# Altium schematic sheet MODEM_PT1.SchDoc: EC200U, SIM, USB, ANT
size 420 x 297 mm; SheetNumber: 3
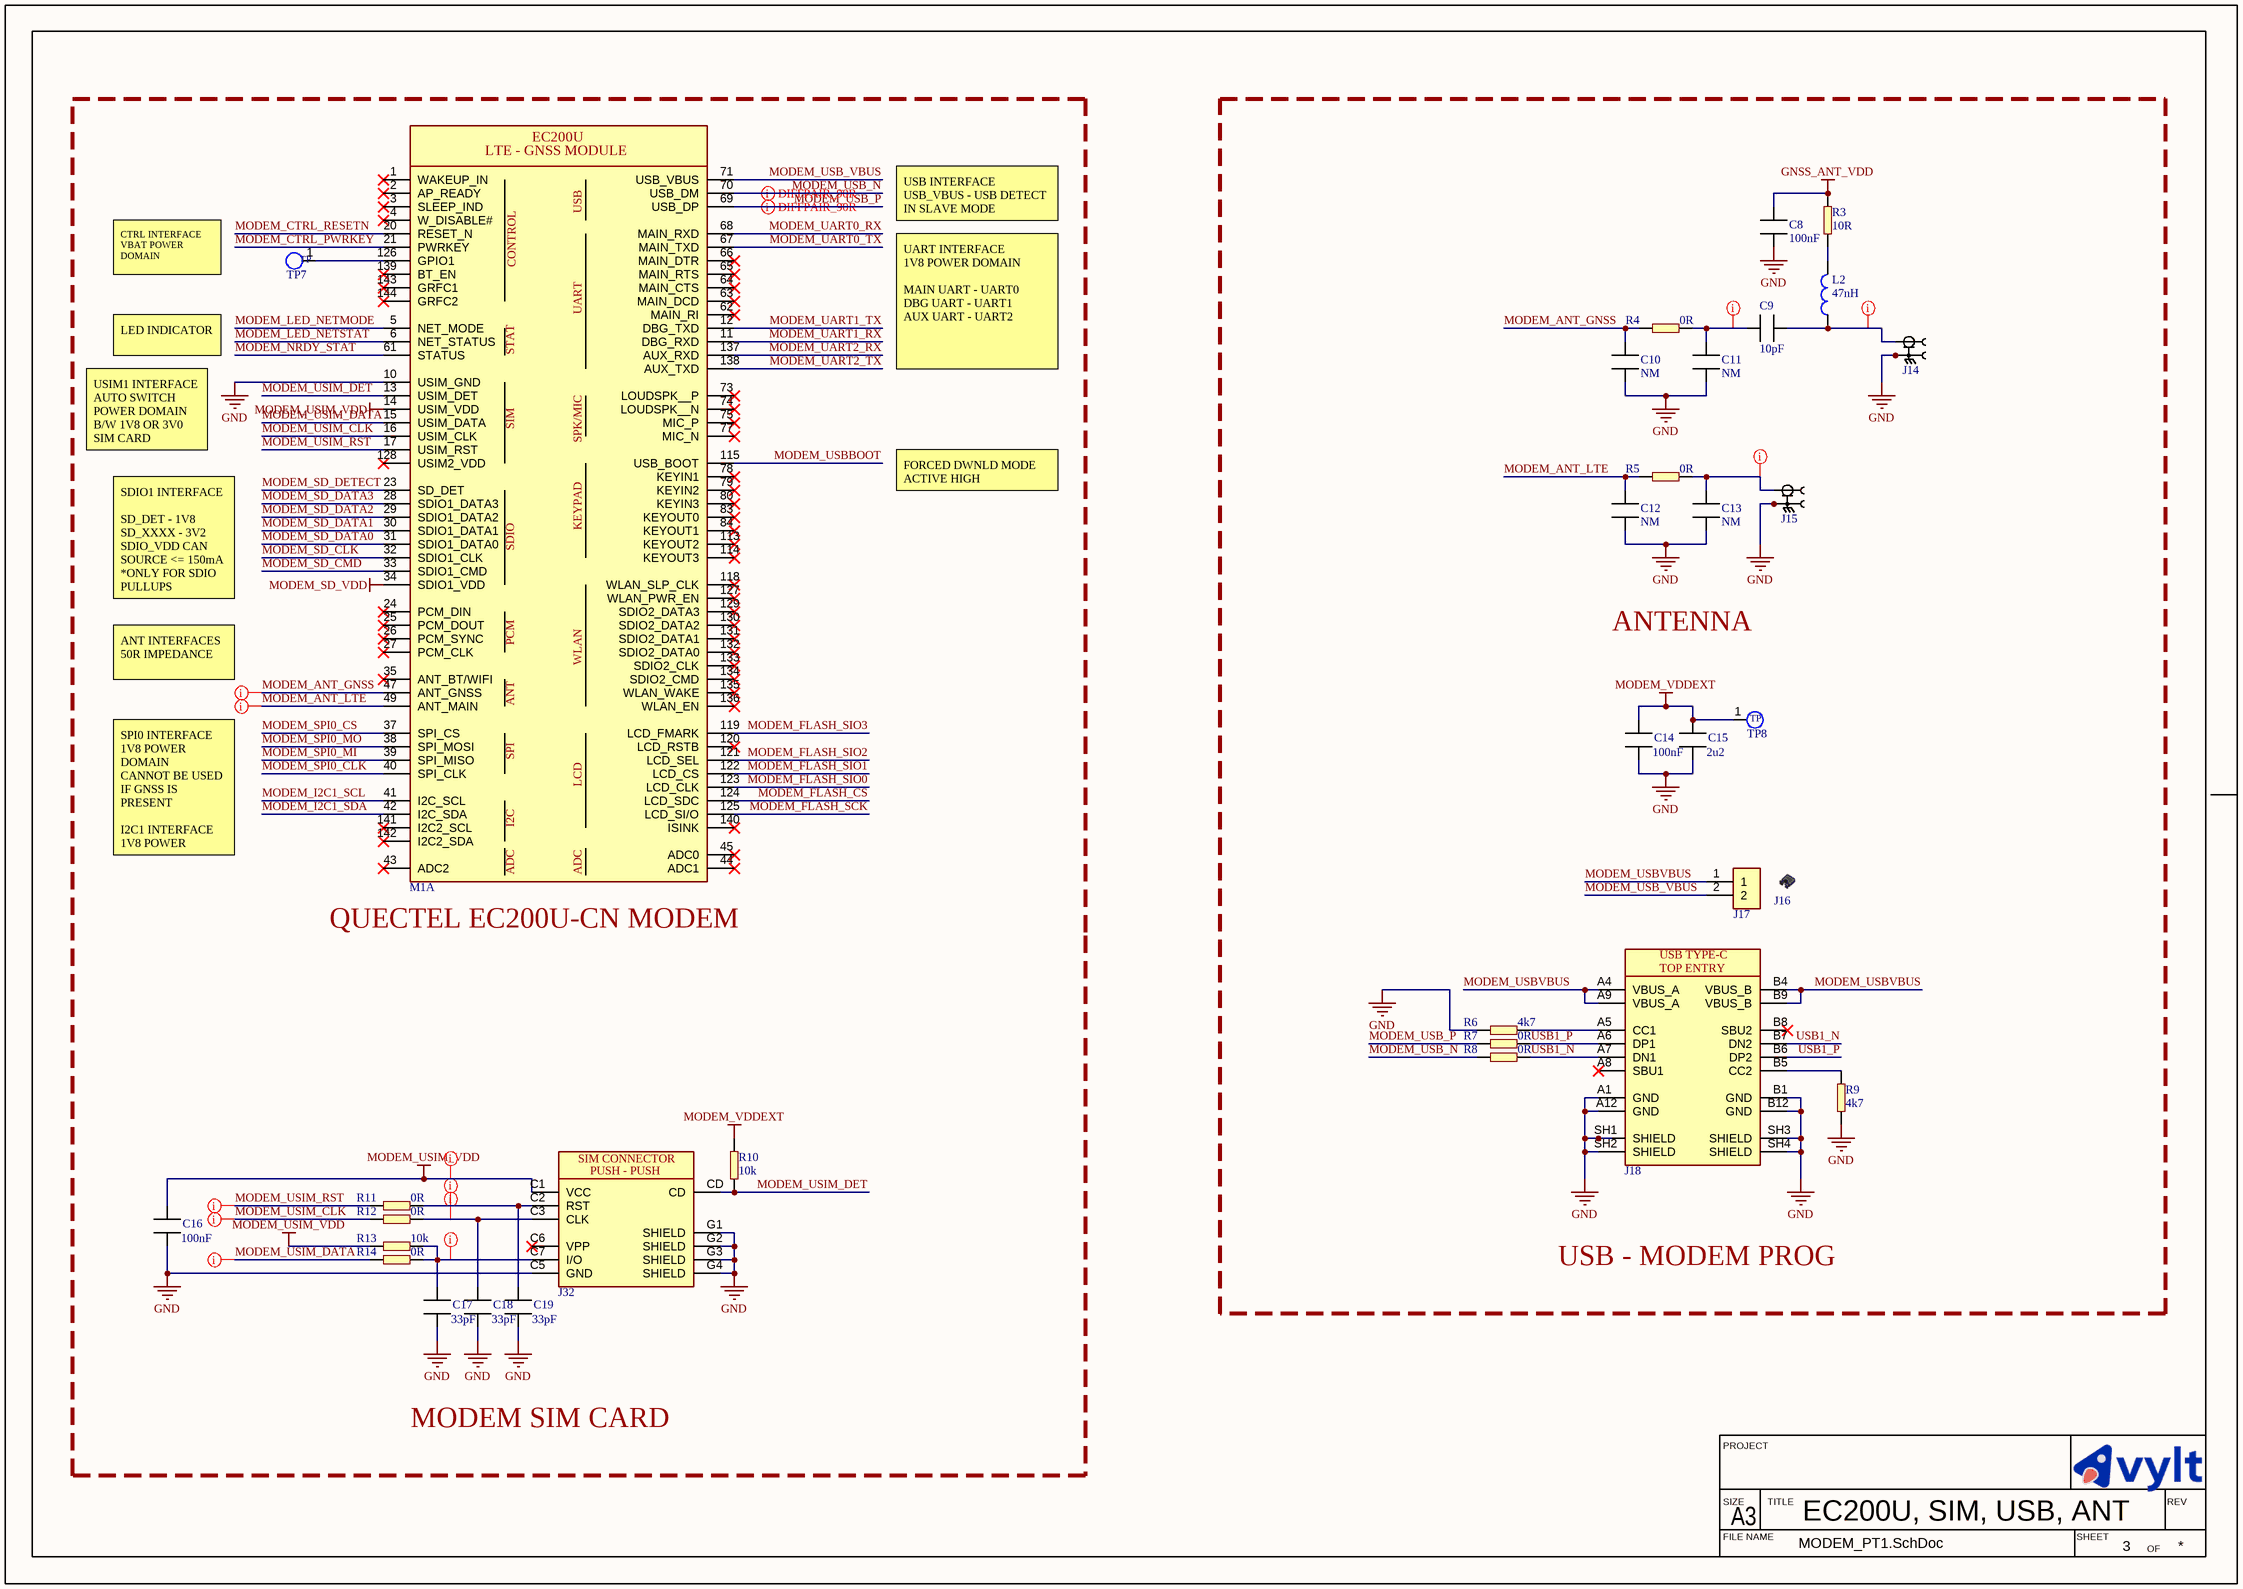
[diagram p0: MODEM_PT1.SchDoc]

## Parts
C8  value 100nF  [CAPC2012X13L]  (hidden comment: MLCC_0805)  (no BOM)
C9  value 10pF  [CAPC0603X03L]  (hidden comment: ERP_102-1)
C10  value NM  [CAPC0603X03L]  (hidden comment: ERP_102-1)  (no BOM)
C11  value NM  [CAPC0603X03L]  (hidden comment: ERP_102-1)  (no BOM)
C12  value NM  [CAPC0603X03L]  (hidden comment: ERP_102-1)  (no BOM)
C13  value NM  [CAPC0603X03L]  (hidden comment: ERP_102-1)  (no BOM)
C14  value 100nF  [CAPC2012X13L]  (hidden comment: MLCC_0805)
C15  value 2u2  [CAPC2012X13L]  (hidden comment: MLCC_0805)
C16  value 100nF  [CAPC2012X13L]  (hidden comment: MLCC_0805)
C17  value 33pF  [CAPC2012X13L]  (hidden comment: MLCC_0805)
C18  value 33pF  [CAPC2012X13L]  (hidden comment: MLCC_0805)
C19  value 33pF  [CAPC2012X13L]  (hidden comment: MLCC_0805)
J14  ERP_148-1  [uFL_50R]  (value not drawn)
J15  ERP_148-1  [uFL_50R]  (value not drawn)
J16  Jumper Cap  (value not drawn)  (mechanical)
J17  2PX1R  [2PX1R]  (value not drawn)
J18  GSB1CA11101DSHR  [GSB1CA11101DSHR]  (value not drawn)
J32  MUP-7801-1  [MUP-7801-1]  (value not drawn)
L2  value 47nH  [IND_0603]  (hidden comment: ERP_103-3)
M1  EC200U  [EC200U]  (value not drawn)  (part A of 2)
R3  value 10R  [RES_0603]  (hidden comment: ERP_101-1)
R4  value 0R  [RESC0603X03L]  (hidden comment: ERP_101-1)
R5  value 0R  [RESC0603X03L]  (hidden comment: ERP_101-1)
R6  value 4k7  [RES_0603]  (hidden comment: ERP_101-1)
R7  value 0R  [RES_0603]  (hidden comment: ERP_101-1)
R8  value 0R  [RES_0603]  (hidden comment: ERP_101-1)
R9  value 4k7  [RES_0603]  (hidden comment: ERP_101-1)
R10  value 10k  [RES_0603]  (hidden comment: ERP_101-1)
R11  value 0R  [RES_0603]  (hidden comment: ERP_101-1)
R12  value 0R  [RES_0603]  (hidden comment: ERP_101-1)
R13  value 10k  [RES_0603]  (hidden comment: ERP_101-1)
R14  value 0R  [RES_0603]  (hidden comment: ERP_101-1)
TP7  TP_1MM  [TP_1MM]  (value not drawn)  (no BOM)
TP8  TP_1MM  [TP_1MM]  (value not drawn)  (no BOM)

## Nets
GND: C8.2 C10.1 C11.1 C12.1 C13.1 C14.2 C15.2 C16.2 C17.2 C18.2 C19.2 J14.1 J14.2 J15.1 J15.2 J18.A1(GND) J18.A12(GND) J18.B1(GND) J18.B12(GND) J18.SH1(SHIELD) J18.SH2(SHIELD) J18.SH3(SHIELD) J18.SH4(SHIELD) J32.C5(GND) J32.G1(SHIELD) J32.G2(SHIELD) J32.G3(SHIELD) J32.G4(SHIELD) M1.10(USIM_GND) R6.2 R9.2
GNSS_ANT_VDD: C8.1 R3.2
MODEM_SD_VDD: M1.34(SDIO1_VDD)
MODEM_USIM_VDD: C16.1 J32.C1(VCC) M1.14(USIM_VDD) R13.2
MODEM_VDDEXT: C14.1 C15.1 R10.2 TP8.1
MODEM_ANT_GNSS: C10.2 M1.47(ANT_GNSS) R4.2
MODEM_ANT_LTE: C12.2 M1.49(ANT_MAIN) R5.2
MODEM_CTRL_PWRKEY: M1.21(PWRKEY)
MODEM_CTRL_RESETN: M1.20(RESET_N)
MODEM_FLASH_CS: M1.124(LCD_SDC)
MODEM_FLASH_SCK: M1.125(LCD_SI/O)
MODEM_FLASH_SIO0: M1.123(LCD_CLK)
MODEM_FLASH_SIO1: M1.122(LCD_CS)
MODEM_FLASH_SIO2: M1.121(LCD_SEL)
MODEM_FLASH_SIO3: M1.119(LCD_FMARK)
MODEM_I2C1_SCL: M1.41(I2C_SCL)
MODEM_I2C1_SDA: M1.42(I2C_SDA)
MODEM_LED_NETMODE: M1.5(NET_MODE)
MODEM_LED_NETSTAT: M1.6(NET_STATUS)
MODEM_NRDY_STAT: M1.61(STATUS)
MODEM_SD_CLK: M1.32(SDIO1_CLK)
MODEM_SD_CMD: M1.33(SDIO1_CMD)
MODEM_SD_DATA0: M1.31(SDIO1_DATA0)
MODEM_SD_DATA1: M1.30(SDIO1_DATA1)
MODEM_SD_DATA2: M1.29(SDIO1_DATA2)
MODEM_SD_DATA3: M1.28(SDIO1_DATA3)
MODEM_SD_DETECT: M1.23(SD_DET)
MODEM_SPI0_CLK: M1.40(SPI_CLK)
MODEM_SPI0_CS: M1.37(SPI_CS)
MODEM_SPI0_MI: M1.39(SPI_MISO)
MODEM_SPI0_MO: M1.38(SPI_MOSI)
MODEM_UART0_RX: M1.68(MAIN_RXD)
MODEM_UART0_TX: M1.67(MAIN_TXD)
MODEM_UART1_RX: M1.11(DBG_RXD)
MODEM_UART1_TX: M1.12(DBG_TXD)
MODEM_UART2_RX: M1.137(AUX_RXD)
MODEM_UART2_TX: M1.138(AUX_TXD)
MODEM_USB_N: M1.70(USB_DM) R8.2
MODEM_USB_P: M1.69(USB_DP) R7.2
MODEM_USB_VBUS: J17.2 M1.71(USB_VBUS)
MODEM_USBBOOT: M1.115(USB_BOOT)
MODEM_USBVBUS: J17.1 J18.A4(VBUS_A) J18.A9(VBUS_A) J18.B4(VBUS_B) J18.B9(VBUS_B)
MODEM_USIM_CLK: M1.16(USIM_CLK) R12.2
MODEM_USIM_DATA: M1.15(USIM_DATA) R14.2
MODEM_USIM_DET: J32.CD M1.13(USIM_DET) R10.1
MODEM_USIM_RST: M1.17(USIM_RST) R11.2
USB1_N: J18.A7(DN1) J18.B7(DN2) R8.1
USB1_P: J18.A6(DP1) J18.B6(DP2) R7.1
NetC9_1: C9.1 J14.3 L2.1
NetC9_2: C9.2 C11.2 R4.1
NetC13_2: C13.2 J15.3 R5.1
NetC17_1: C17.1 J32.C7(I/O) R13.1 R14.1
NetC18_1: C18.1 J32.C3(CLK) R12.1
NetC19_1: C19.1 J32.C2(RST) R11.1
NetJ18_A5: J18.A5(CC1) R6.1
NetJ18_B5: J18.B5(CC2) R9.1
NetL2_2: L2.2 R3.1
NetM1_126: M1.126(GPIO1) TP7.1

Not connected (* = marked no-connect by the designer): J18 A8(SBU1)* B8(SBU2)*; J32 C6(VPP)*; M1 1(WAKEUP_IN)* 2(AP_READY)* 3(SLEEP_IND)* 4(W_DISABLE#)* 24(PCM_DIN)* 25(PCM_DOUT)* 26(PCM_SYNC)* 27(PCM_CLK)* 35(ANT_BT/WIFI)* 43(ADC2)* 44(ADC1)* 45(ADC0)* 62(MAIN_RI)* 63(MAIN_DCD)* 64(MAIN_CTS)* 65(MAIN_RTS)* 66(MAIN_DTR)* 73(LOUDSPK__P)* 74(LOUDSPK__N)* 75(MIC_P)* 77(MIC_N)* 78(KEYIN1)* 79(KEYIN2)* 80(KEYIN3)* 83(KEYOUT0)* 84(KEYOUT1)* 113(KEYOUT2)* 114(KEYOUT3)* 118(WLAN_SLP_CLK)* 120(LCD_RSTB)* 127(WLAN_PWR_EN)* 128(USIM2_VDD)* 129(SDIO2_DATA3)* 130(SDIO2_DATA2)* 131(SDIO2_DATA1)* 132(SDIO2_DATA0)* 133(SDIO2_CLK)* 134(SDIO2_CMD)* 135(WLAN_WAKE)* 136(WLAN_EN)* 139(BT_EN)* 140(ISINK)* 141(I2C2_SCL)* 142(I2C2_SDA)* 143(GRFC1)* 144(GRFC2)*

## Layout directives
differential pair; differential pair class USB_90R; rule Differential Pairs Routing [Pref Gap = 10mil    Min Gap  = 10mil    Max Gap  = 10milPref Width = 12.778mil    Min Width  = 12.778mil    Max Width  = 12.778mil]: MODEM_USB_N
differential pair; rule Differential Pairs Routing [Pref Gap = 10mil    Min Gap  = 10mil    Max Gap  = 10milPref Width = 12.778mil    Min Width  = 12.778mil    Max Width  = 12.778mil]; differential pair class USB_90R: MODEM_USB_P
net class ANT_50R; rule Width Constraint [Pref Impedance = 50.00ohms    Min Impedance = 50.00ohms    Max Impedance = 50.00ohms]: MODEM_ANT_GNSS, MODEM_ANT_LTE, NetC9_1, NetC9_2, NetC13_2
rule Width Constraint [Pref Impedance = 50.00ohms    Min Impedance = 50.00ohms    Max Impedance = 50.00ohms]: MODEM_USIM_CLK, MODEM_USIM_DATA, MODEM_USIM_RST, MODEM_USIM_VDD, NetC17_1, NetC18_1, NetC19_1

## Notes on the sheet
- USB INTERFACE
  USB_VBUS - USB DETECT IN SLAVE MODE
- CTRL INTERFACE
  VBAT POWER DOMAIN
- LED INDICATOR
- UART INTERFACE
  1V8 POWER DOMAIN
  MAIN UART - UART0
  DBG UART - UART1
  AUX UART - UART2
- USIM1 INTERFACE
  AUTO SWITCH POWER DOMAIN B/W 1V8 OR 3V0 SIM CARD
- FORCED DWNLD MODE
  ACTIVE HIGH
- SDIO1 INTERFACE
  SD_DET - 1V8
  SD_XXXX - 3V2
  SDIO_VDD CAN SOURCE <= 150mA
  *ONLY FOR SDIO PULLUPS
- ANTENNA
- ANT INTERFACES
  50R IMPEDANCE
- SPI0 INTERFACE
  1V8 POWER DOMAIN
  CANNOT BE USED IF GNSS IS PRESENT
  I2C1 INTERFACE
  1V8 POWER DOMAIN
- (near M1) QUECTEL EC200U-CN MODEM
- USB - MODEM PROG
- MODEM SIM CARD
- PROJECT
- SIZE
- FILE NAME
- A3
- TITLE
- SHEET
- OF
- REV
- (in symbol EC200U, part A) LTE - GNSS MODULE; USB; CONTROL; UART; STAT; SIM; SPK/MIC; KEYPAD; SDIO; PCM; WLAN; ANT; SPI; LCD; I2C; ADC
- (in symbol GSB1CA11101DSHR) USB TYPE-C; TOP ENTRY
- (in symbol MUP-7801-1) SIM CONNECTOR; PUSH - PUSH
- (in symbol TP_1MM) TP

## Library data of the parts
C8 C14-C19 = MLCC_0805: Chip Capacitor, 2-Leads, Body 2.00x1.25mm, IPC High Density; Package: 0805; Manufacturer 1: *; Manufacturer Part Number 1: *
C9-C13 = MLCC_0201: Chip Capacitor, 2-Leads, Body 0.60x0.30mm, IPC High Density; Package: 0201; Manufacturer 1: *; Manufacturer Part Number 1: *
J14 J15 = uFL_50R: Package: L3W3; Value: *; ERP: *; Manufacturer 1: *; Manufacturer Part Number 1: *; Supplier 1: *; Suuplier Part Number 1: *
J16 = Jumper Cap: 2 Pin Jumper Cap P2.54; Manufacturer Part Number 1: *; Manufacturer 1: *; Value: *
J18 = GSB1CA11101DSHR: USB-C (USB TYPE-C) USB 2.0 Receptacle Connector 24 (16+8 Dummy) Position Surface Mount, Through Hole; Manufacturer 1: Amphenol ICC (Commercial Products); Value: MUP-U23010-02; Manufacturer Part Number 1: GSB1CA11101DSHR; Package: 24 (16+8 Dummy)
J32 = MUP-7801-1: 7 (6 + 1) Position Card Connector NANO SIM Surface Mount, Right Angle Gold; Manufacturer Part Number 1: MUP-C7801-02; Manufacturer 1: MUP; Package: 7 (6 + 1); Value: *; Supplier Part Number 1: ST2103SD1921
L2 = IND_0603: ERP: *; Suuplier Part Number 1: *; Supplier 1: *; Manufacturer Part Number 1: *; Manufacturer 1: *; Package: 0603
M1 = EC200U: LTE CAT1 MODEM 144 SMD; Manufacturer 1: Quectel; Manufacturer Part Number 1: 027-EC200UCNAA-N05-SGNSA; Value: *
R3 R6-R14 = RES_0603: Package: 0603; Manufacturer 1: *; Manufacturer Part Number 1: *
R4 R5 = RES_0201: Package: 0201; Manufacturer 1: *; Manufacturer Part Number 1: *